# Altium project LimeSDR-X3_1v2.PrjPcb (part 9 of 20)

## Sheet 18_FPGA_B16_B33_B34_B35.SchDoc: FPGA Banks 16, 33, 34, 35
size A3; Organization: Lime Microsystems; Address1: Surrey Tech Centre; Address2: Guildford GU2 7YG; Address3: Surrey; Address4: United Kingdom; Revision: 1.2; SheetNumber: 18; SheetTotal: 31
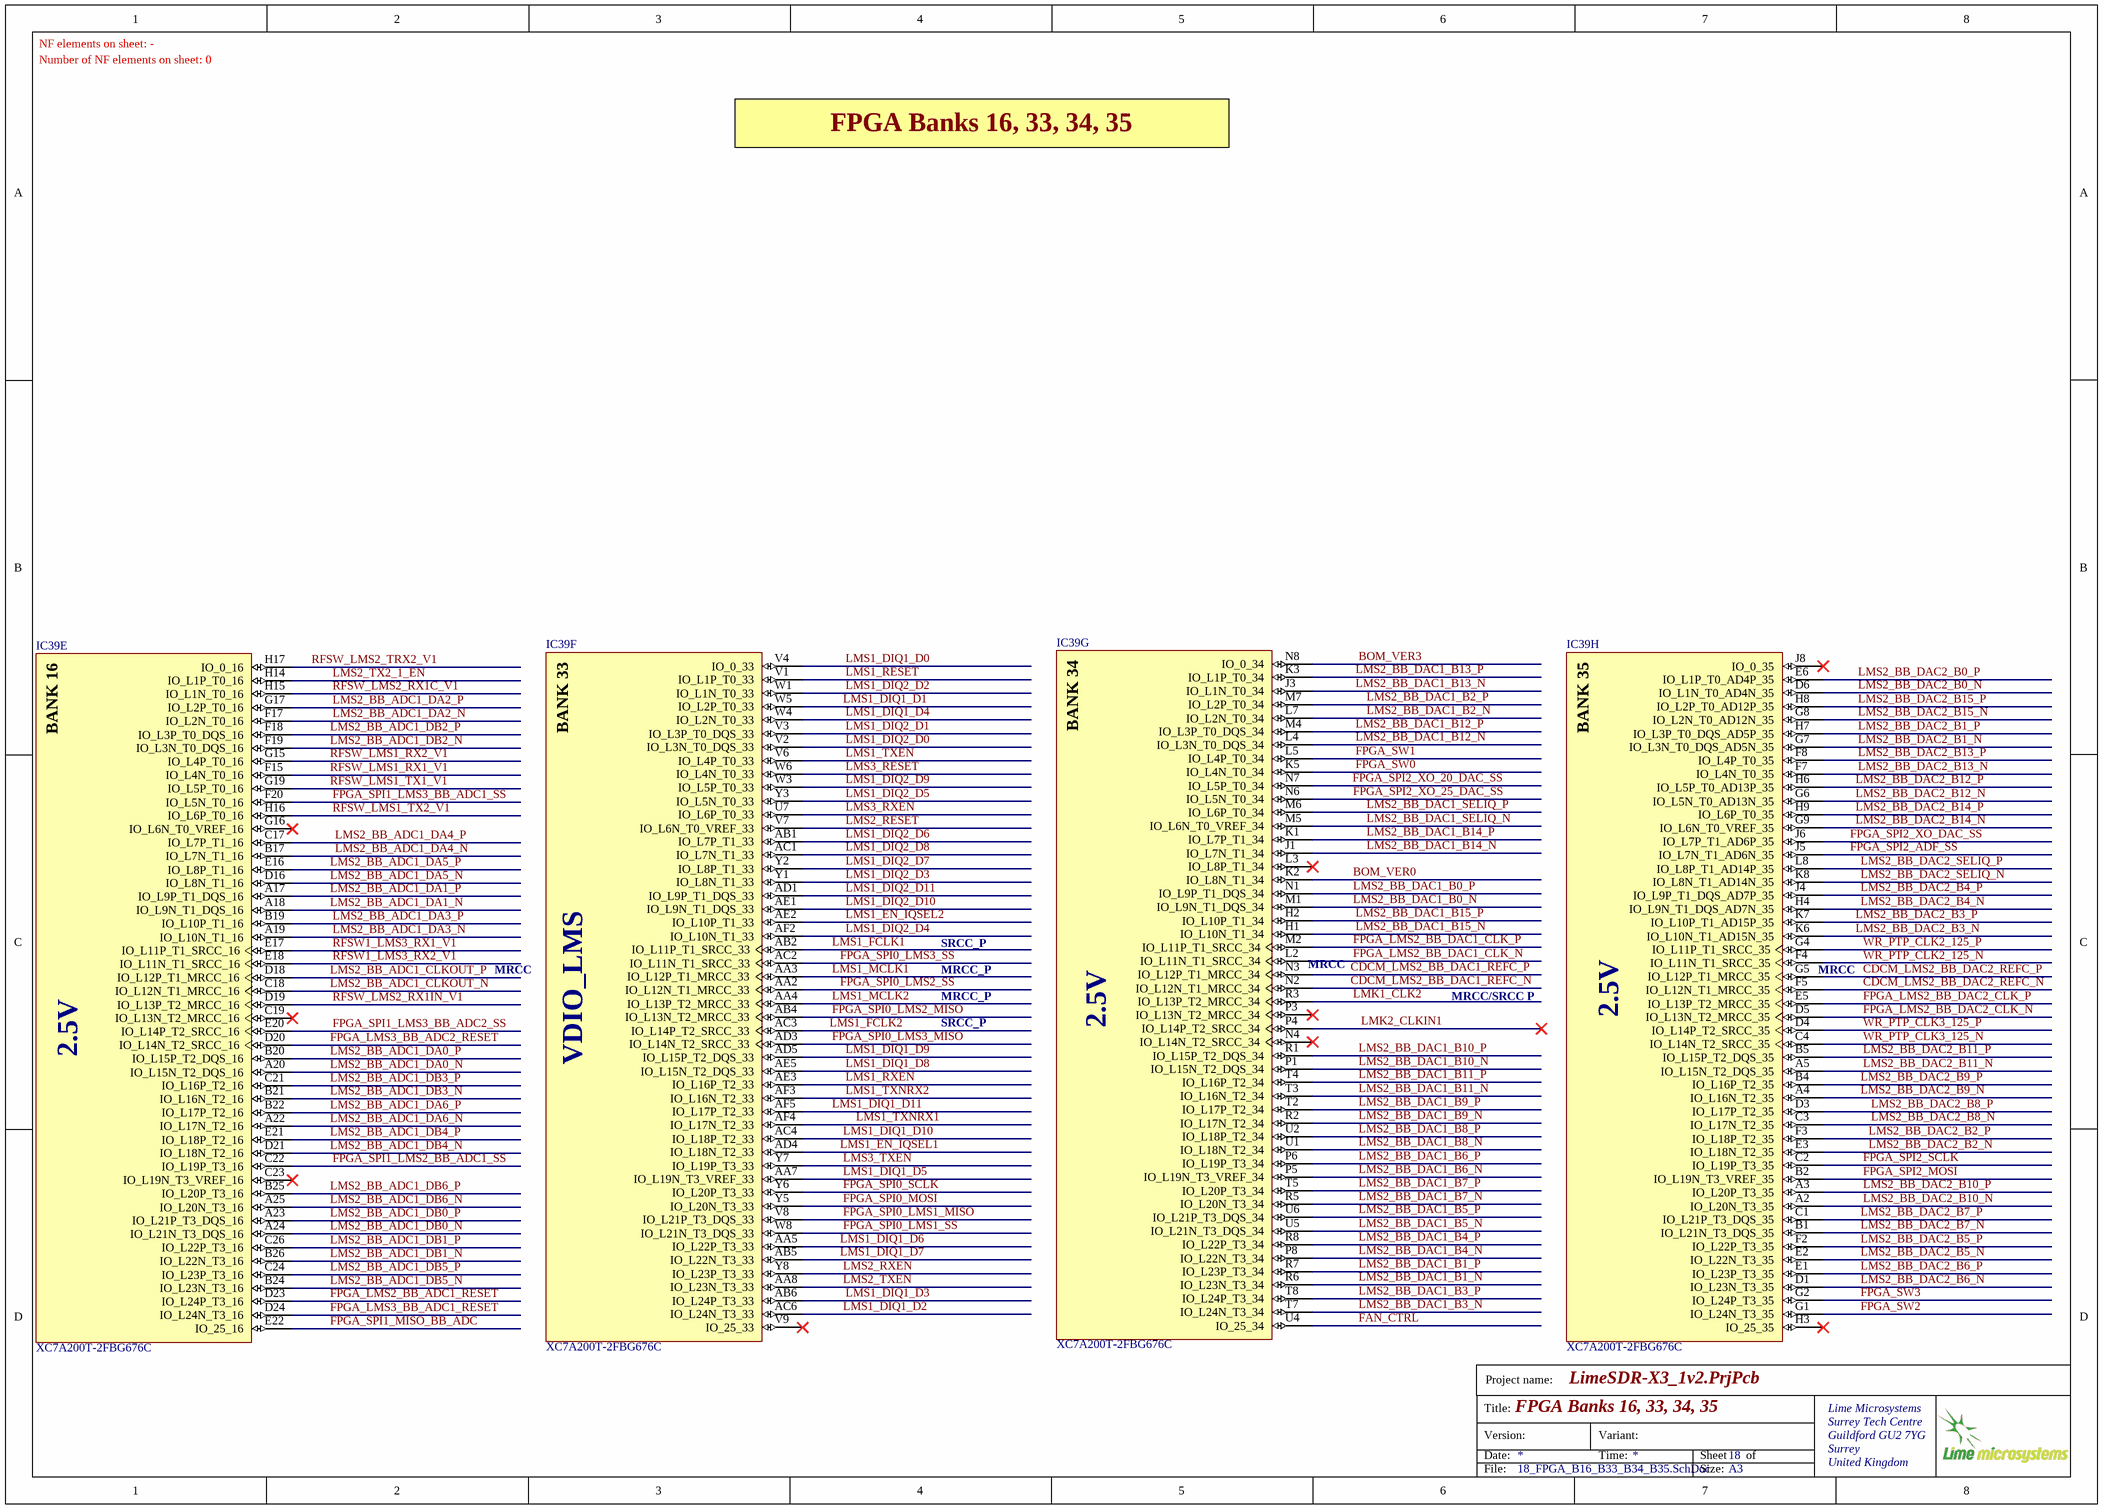
[diagram p17: 18_FPGA_B16_B33_B34_B35.SchDoc]

### Parts
IC39  XC7A200T-2FBG676C  [XC7A200T-2FBG676C_FBG676]  (parts E,F,G,H of 14)

### Nets
BOM_VER0: IC39.K2(IO_L8N_T1_34)
BOM_VER3: IC39.N8(IO_0_34)
CDCM_LMS2_BB_DAC1_REFC_N: IC39.N2(IO_L12N_T1_MRCC_34)
CDCM_LMS2_BB_DAC1_REFC_P: IC39.N3(IO_L12P_T1_MRCC_34)
CDCM_LMS2_BB_DAC2_REFC_N: IC39.F5(IO_L12N_T1_MRCC_35)
CDCM_LMS2_BB_DAC2_REFC_P: IC39.G5(IO_L12P_T1_MRCC_35)
FAN_CTRL: IC39.U4(IO_25_34)
FPGA_LMS2_BB_ADC1_RESET: IC39.D23(IO_L24P_T3_16)
FPGA_LMS2_BB_DAC1_CLK_N: IC39.L2(IO_L11N_T1_SRCC_34)
FPGA_LMS2_BB_DAC1_CLK_P: IC39.M2(IO_L11P_T1_SRCC_34)
FPGA_LMS2_BB_DAC2_CLK_N: IC39.D5(IO_L13N_T2_MRCC_35)
FPGA_LMS2_BB_DAC2_CLK_P: IC39.E5(IO_L13P_T2_MRCC_35)
FPGA_LMS3_BB_ADC1_RESET: IC39.D24(IO_L24N_T3_16)
FPGA_LMS3_BB_ADC2_RESET: IC39.D20(IO_L14N_T2_SRCC_16)
FPGA_SPI0_LMS1_MISO: IC39.V8(IO_L21P_T3_DQS_33)
FPGA_SPI0_LMS1_SS: IC39.W8(IO_L21N_T3_DQS_33)
FPGA_SPI0_LMS2_MISO: IC39.AB4(IO_L13N_T2_MRCC_33)
FPGA_SPI0_LMS2_SS: IC39.AA2(IO_L12N_T1_MRCC_33)
FPGA_SPI0_LMS3_MISO: IC39.AD3(IO_L14N_T2_SRCC_33)
FPGA_SPI0_LMS3_SS: IC39.AC2(IO_L11N_T1_SRCC_33)
FPGA_SPI0_MOSI: IC39.Y5(IO_L20N_T3_33)
FPGA_SPI0_SCLK: IC39.Y6(IO_L20P_T3_33)
FPGA_SPI1_LMS2_BB_ADC1_SS: IC39.C22(IO_L19P_T3_16)
FPGA_SPI1_LMS3_BB_ADC1_SS: IC39.F20(IO_L5N_T0_16)
FPGA_SPI1_LMS3_BB_ADC2_SS: IC39.E20(IO_L14P_T2_SRCC_16)
FPGA_SPI1_MISO_BB_ADC: IC39.E22(IO_25_16)
FPGA_SPI2_ADF_SS: IC39.J5(IO_L7N_T1_AD6N_35)
FPGA_SPI2_MOSI: IC39.B2(IO_L19N_T3_VREF_35)
FPGA_SPI2_SCLK: IC39.C2(IO_L19P_T3_35)
FPGA_SPI2_XO_20_DAC_SS: IC39.N7(IO_L5P_T0_34)
FPGA_SPI2_XO_25_DAC_SS: IC39.N6(IO_L5N_T0_34)
FPGA_SPI2_XO_DAC_SS: IC39.J6(IO_L7P_T1_AD6P_35)
FPGA_SW0: IC39.K5(IO_L4N_T0_34)
FPGA_SW1: IC39.L5(IO_L4P_T0_34)
FPGA_SW2: IC39.G1(IO_L24N_T3_35)
FPGA_SW3: IC39.G2(IO_L24P_T3_35)
LMK1_CLK2: IC39.R3(IO_L13P_T2_MRCC_34)
LMK2_CLKIN1: IC39.P4(IO_L14P_T2_SRCC_34)
LMS1_DIQ1_D0: IC39.V4(IO_0_33)
LMS1_DIQ1_D1: IC39.W5(IO_L2P_T0_33)
LMS1_DIQ1_D2: IC39.AC6(IO_L24N_T3_33)
LMS1_DIQ1_D3: IC39.AB6(IO_L24P_T3_33)
LMS1_DIQ1_D4: IC39.W4(IO_L2N_T0_33)
LMS1_DIQ1_D5: IC39.AA7(IO_L19N_T3_VREF_33)
LMS1_DIQ1_D6: IC39.AA5(IO_L22P_T3_33)
LMS1_DIQ1_D7: IC39.AB5(IO_L22N_T3_33)
LMS1_DIQ1_D8: IC39.AE5(IO_L15N_T2_DQS_33)
LMS1_DIQ1_D9: IC39.AD5(IO_L15P_T2_DQS_33)
LMS1_DIQ1_D10: IC39.AC4(IO_L18P_T2_33)
LMS1_DIQ1_D11: IC39.AF5(IO_L17P_T2_33)
LMS1_DIQ2_D0: IC39.V2(IO_L3N_T0_DQS_33)
LMS1_DIQ2_D1: IC39.V3(IO_L3P_T0_DQS_33)
LMS1_DIQ2_D2: IC39.W1(IO_L1N_T0_33)
LMS1_DIQ2_D3: IC39.Y1(IO_L8N_T1_33)
LMS1_DIQ2_D4: IC39.AF2(IO_L10N_T1_33)
LMS1_DIQ2_D5: IC39.Y3(IO_L5N_T0_33)
LMS1_DIQ2_D6: IC39.AB1(IO_L7P_T1_33)
LMS1_DIQ2_D7: IC39.Y2(IO_L8P_T1_33)
LMS1_DIQ2_D8: IC39.AC1(IO_L7N_T1_33)
LMS1_DIQ2_D9: IC39.W3(IO_L5P_T0_33)
LMS1_DIQ2_D10: IC39.AE1(IO_L9N_T1_DQS_33)
LMS1_DIQ2_D11: IC39.AD1(IO_L9P_T1_DQS_33)
LMS1_EN_IQSEL1: IC39.AD4(IO_L18N_T2_33)
LMS1_EN_IQSEL2: IC39.AE2(IO_L10P_T1_33)
LMS1_FCLK1: IC39.AB2(IO_L11P_T1_SRCC_33)
LMS1_FCLK2: IC39.AC3(IO_L14P_T2_SRCC_33)
LMS1_MCLK1: IC39.AA3(IO_L12P_T1_MRCC_33)
LMS1_MCLK2: IC39.AA4(IO_L13P_T2_MRCC_33)
LMS1_RESET: IC39.V1(IO_L1P_T0_33)
LMS1_RXEN: IC39.AE3(IO_L16P_T2_33)
LMS1_TXEN: IC39.V6(IO_L4P_T0_33)
LMS1_TXNRX1: IC39.AF4(IO_L17N_T2_33)
LMS1_TXNRX2: IC39.AF3(IO_L16N_T2_33)
LMS2_BB_ADC1_CLKOUT_N: IC39.C18(IO_L12N_T1_MRCC_16)
LMS2_BB_ADC1_CLKOUT_P: IC39.D18(IO_L12P_T1_MRCC_16)
LMS2_BB_ADC1_DA0_N: IC39.A20(IO_L15N_T2_DQS_16)
LMS2_BB_ADC1_DA0_P: IC39.B20(IO_L15P_T2_DQS_16)
LMS2_BB_ADC1_DA1_N: IC39.A18(IO_L9N_T1_DQS_16)
LMS2_BB_ADC1_DA1_P: IC39.A17(IO_L9P_T1_DQS_16)
LMS2_BB_ADC1_DA2_N: IC39.F17(IO_L2N_T0_16)
LMS2_BB_ADC1_DA2_P: IC39.G17(IO_L2P_T0_16)
LMS2_BB_ADC1_DA3_N: IC39.A19(IO_L10N_T1_16)
LMS2_BB_ADC1_DA3_P: IC39.B19(IO_L10P_T1_16)
LMS2_BB_ADC1_DA4_N: IC39.B17(IO_L7N_T1_16)
LMS2_BB_ADC1_DA4_P: IC39.C17(IO_L7P_T1_16)
LMS2_BB_ADC1_DA5_N: IC39.D16(IO_L8N_T1_16)
LMS2_BB_ADC1_DA5_P: IC39.E16(IO_L8P_T1_16)
LMS2_BB_ADC1_DA6_N: IC39.A22(IO_L17N_T2_16)
LMS2_BB_ADC1_DA6_P: IC39.B22(IO_L17P_T2_16)
LMS2_BB_ADC1_DB0_N: IC39.A24(IO_L21N_T3_DQS_16)
LMS2_BB_ADC1_DB0_P: IC39.A23(IO_L21P_T3_DQS_16)
LMS2_BB_ADC1_DB1_N: IC39.B26(IO_L22N_T3_16)
LMS2_BB_ADC1_DB1_P: IC39.C26(IO_L22P_T3_16)
LMS2_BB_ADC1_DB2_N: IC39.F19(IO_L3N_T0_DQS_16)
LMS2_BB_ADC1_DB2_P: IC39.F18(IO_L3P_T0_DQS_16)
LMS2_BB_ADC1_DB3_N: IC39.B21(IO_L16N_T2_16)
LMS2_BB_ADC1_DB3_P: IC39.C21(IO_L16P_T2_16)
LMS2_BB_ADC1_DB4_N: IC39.D21(IO_L18N_T2_16)
LMS2_BB_ADC1_DB4_P: IC39.E21(IO_L18P_T2_16)
LMS2_BB_ADC1_DB5_N: IC39.B24(IO_L23N_T3_16)
LMS2_BB_ADC1_DB5_P: IC39.C24(IO_L23P_T3_16)
LMS2_BB_ADC1_DB6_N: IC39.A25(IO_L20N_T3_16)
LMS2_BB_ADC1_DB6_P: IC39.B25(IO_L20P_T3_16)
LMS2_BB_DAC1_B0_N: IC39.M1(IO_L9N_T1_DQS_34)
LMS2_BB_DAC1_B0_P: IC39.N1(IO_L9P_T1_DQS_34)
LMS2_BB_DAC1_B1_N: IC39.R6(IO_L23N_T3_34)
LMS2_BB_DAC1_B1_P: IC39.R7(IO_L23P_T3_34)
LMS2_BB_DAC1_B2_N: IC39.L7(IO_L2N_T0_34)
LMS2_BB_DAC1_B2_P: IC39.M7(IO_L2P_T0_34)
LMS2_BB_DAC1_B3_N: IC39.T7(IO_L24N_T3_34)
LMS2_BB_DAC1_B3_P: IC39.T8(IO_L24P_T3_34)
LMS2_BB_DAC1_B4_N: IC39.P8(IO_L22N_T3_34)
LMS2_BB_DAC1_B4_P: IC39.R8(IO_L22P_T3_34)
LMS2_BB_DAC1_B5_N: IC39.U5(IO_L21N_T3_DQS_34)
LMS2_BB_DAC1_B5_P: IC39.U6(IO_L21P_T3_DQS_34)
LMS2_BB_DAC1_B6_N: IC39.P5(IO_L19N_T3_VREF_34)
LMS2_BB_DAC1_B6_P: IC39.P6(IO_L19P_T3_34)
LMS2_BB_DAC1_B7_N: IC39.R5(IO_L20N_T3_34)
LMS2_BB_DAC1_B7_P: IC39.T5(IO_L20P_T3_34)
LMS2_BB_DAC1_B8_N: IC39.U1(IO_L18N_T2_34)
LMS2_BB_DAC1_B8_P: IC39.U2(IO_L18P_T2_34)
LMS2_BB_DAC1_B9_N: IC39.R2(IO_L17N_T2_34)
LMS2_BB_DAC1_B9_P: IC39.T2(IO_L17P_T2_34)
LMS2_BB_DAC1_B10_N: IC39.P1(IO_L15N_T2_DQS_34)
LMS2_BB_DAC1_B10_P: IC39.R1(IO_L15P_T2_DQS_34)
LMS2_BB_DAC1_B11_N: IC39.T3(IO_L16N_T2_34)
LMS2_BB_DAC1_B11_P: IC39.T4(IO_L16P_T2_34)
LMS2_BB_DAC1_B12_N: IC39.L4(IO_L3N_T0_DQS_34)
LMS2_BB_DAC1_B12_P: IC39.M4(IO_L3P_T0_DQS_34)
LMS2_BB_DAC1_B13_N: IC39.J3(IO_L1N_T0_34)
LMS2_BB_DAC1_B13_P: IC39.K3(IO_L1P_T0_34)
LMS2_BB_DAC1_B14_N: IC39.J1(IO_L7N_T1_34)
LMS2_BB_DAC1_B14_P: IC39.K1(IO_L7P_T1_34)
LMS2_BB_DAC1_B15_N: IC39.H1(IO_L10N_T1_34)
LMS2_BB_DAC1_B15_P: IC39.H2(IO_L10P_T1_34)
LMS2_BB_DAC1_SELIQ_N: IC39.M5(IO_L6N_T0_VREF_34)
LMS2_BB_DAC1_SELIQ_P: IC39.M6(IO_L6P_T0_34)
LMS2_BB_DAC2_B0_N: IC39.D6(IO_L1N_T0_AD4N_35)
LMS2_BB_DAC2_B0_P: IC39.E6(IO_L1P_T0_AD4P_35)
LMS2_BB_DAC2_B1_N: IC39.G7(IO_L3N_T0_DQS_AD5N_35)
LMS2_BB_DAC2_B1_P: IC39.H7(IO_L3P_T0_DQS_AD5P_35)
LMS2_BB_DAC2_B2_N: IC39.E3(IO_L18N_T2_35)
LMS2_BB_DAC2_B2_P: IC39.F3(IO_L18P_T2_35)
LMS2_BB_DAC2_B3_N: IC39.K6(IO_L10N_T1_AD15N_35)
LMS2_BB_DAC2_B3_P: IC39.K7(IO_L10P_T1_AD15P_35)
LMS2_BB_DAC2_B4_N: IC39.H4(IO_L9N_T1_DQS_AD7N_35)
LMS2_BB_DAC2_B4_P: IC39.J4(IO_L9P_T1_DQS_AD7P_35)
LMS2_BB_DAC2_B5_N: IC39.E2(IO_L22N_T3_35)
LMS2_BB_DAC2_B5_P: IC39.F2(IO_L22P_T3_35)
LMS2_BB_DAC2_B6_N: IC39.D1(IO_L23N_T3_35)
LMS2_BB_DAC2_B6_P: IC39.E1(IO_L23P_T3_35)
LMS2_BB_DAC2_B7_N: IC39.B1(IO_L21N_T3_DQS_35)
LMS2_BB_DAC2_B7_P: IC39.C1(IO_L21P_T3_DQS_35)
LMS2_BB_DAC2_B8_N: IC39.C3(IO_L17N_T2_35)
LMS2_BB_DAC2_B8_P: IC39.D3(IO_L17P_T2_35)
LMS2_BB_DAC2_B9_N: IC39.A4(IO_L16N_T2_35)
LMS2_BB_DAC2_B9_P: IC39.B4(IO_L16P_T2_35)
LMS2_BB_DAC2_B10_N: IC39.A2(IO_L20N_T3_35)
LMS2_BB_DAC2_B10_P: IC39.A3(IO_L20P_T3_35)
LMS2_BB_DAC2_B11_N: IC39.A5(IO_L15N_T2_DQS_35)
LMS2_BB_DAC2_B11_P: IC39.B5(IO_L15P_T2_DQS_35)
LMS2_BB_DAC2_B12_N: IC39.G6(IO_L5N_T0_AD13N_35)
LMS2_BB_DAC2_B12_P: IC39.H6(IO_L5P_T0_AD13P_35)
LMS2_BB_DAC2_B13_N: IC39.F7(IO_L4N_T0_35)
LMS2_BB_DAC2_B13_P: IC39.F8(IO_L4P_T0_35)
LMS2_BB_DAC2_B14_N: IC39.G9(IO_L6N_T0_VREF_35)
LMS2_BB_DAC2_B14_P: IC39.H9(IO_L6P_T0_35)
LMS2_BB_DAC2_B15_N: IC39.G8(IO_L2N_T0_AD12N_35)
LMS2_BB_DAC2_B15_P: IC39.H8(IO_L2P_T0_AD12P_35)
LMS2_BB_DAC2_SELIQ_N: IC39.K8(IO_L8N_T1_AD14N_35)
LMS2_BB_DAC2_SELIQ_P: IC39.L8(IO_L8P_T1_AD14P_35)
LMS2_RESET: IC39.V7(IO_L6N_T0_VREF_33)
LMS2_RXEN: IC39.Y8(IO_L23P_T3_33)
LMS2_TX2_1_EN: IC39.H14(IO_L1P_T0_16)
LMS2_TXEN: IC39.AA8(IO_L23N_T3_33)
LMS3_RESET: IC39.W6(IO_L4N_T0_33)
LMS3_RXEN: IC39.U7(IO_L6P_T0_33)
LMS3_TXEN: IC39.Y7(IO_L19P_T3_33)
RFSW1_LMS3_RX1_V1: IC39.E17(IO_L11P_T1_SRCC_16)
RFSW1_LMS3_RX2_V1: IC39.E18(IO_L11N_T1_SRCC_16)
RFSW_LMS1_RX1_V1: IC39.F15(IO_L4N_T0_16)
RFSW_LMS1_RX2_V1: IC39.G15(IO_L4P_T0_16)
RFSW_LMS1_TX1_V1: IC39.G19(IO_L5P_T0_16)
RFSW_LMS1_TX2_V1: IC39.H16(IO_L6P_T0_16)
RFSW_LMS2_RX1C_V1: IC39.H15(IO_L1N_T0_16)
RFSW_LMS2_RX1IN_V1: IC39.D19(IO_L13P_T2_MRCC_16)
RFSW_LMS2_TRX2_V1: IC39.H17(IO_0_16)
WR_PTP_CLK2_125_N: IC39.F4(IO_L11N_T1_SRCC_35)
WR_PTP_CLK2_125_P: IC39.G4(IO_L11P_T1_SRCC_35)
WR_PTP_CLK3_125_N: IC39.C4(IO_L14N_T2_SRCC_35)
WR_PTP_CLK3_125_P: IC39.D4(IO_L14P_T2_SRCC_35)

Not connected (* = marked no-connect by the designer): IC39 C19(IO_L13N_T2_MRCC_16)* C23(IO_L19N_T3_VREF_16)* G16(IO_L6N_T0_VREF_16)* H3(IO_25_35)* J8(IO_0_35)* L3(IO_L8P_T1_34)* N4(IO_L14N_T2_SRCC_34)* P3(IO_L13N_T2_MRCC_34)* V9(IO_25_33)*

### Notes on the sheet
- NF elements on sheet: -
- Number of NF elements on sheet: 0
- FPGA Banks 16, 33, 34, 35
- MRCC
- MRCC_P
- SRCC_P
- (near IC39) MRCC
- 2.5V
- MRCC/SRCC P
- VDIO_LMS
- Project name:
- Title:
- Version:
- Date:
- Variant:
- Time:
- Sheet
- of
- File:
- Size:
- A3
- (in symbol XC7A200T-2FBG676C, part E) BANK 16
- (in symbol XC7A200T-2FBG676C, part F) BANK 33
- (in symbol XC7A200T-2FBG676C, part G) BANK 34
- (in symbol XC7A200T-2FBG676C, part H) BANK 35

### Library data of the parts
IC39 = XC7A200T-2FBG676C: as IC39 on sheet 17_FPGA_B12_B13_B14_B15; ComponentLink1Description: Manufacturer URL; ComponentLink1URL: http://www.xilinx.com/; ComponentLink2Description: Datasheet; ComponentLink2URL: http://www.xilinx.com/support/documentation/data_sheets/ds180_7Series_Overview.pdf; ComponentLink3Description: Package Specification; ComponentLink3URL: http://www.xilinx.com/support/documentation/user_guides/ug475_7Series_Pkg_Pinout.pdf; ComponentLink4Description: DC and Switching Characteristics; ComponentLink4URL: http://www.xilinx.com/support/documentation/data_sheets/ds181_Artix_7_Data_Sheet.pdf; ComponentLink5Description: Package File; ComponentLink5URL: http://www.xilinx.com/support/packagefiles/a7packages/xc7a200tfbg676pkg.txt; ComponentLink6Description: Packaging and Pinout; ComponentLink6URL: http://www.xilinx.com/support/documentation/user_guides/ug475_7Series_Pkg_Pinout.pdf; Supplier 1: Digi-Key; Supplier Part Number 1: 122-1865-ND; Manufacturer Part Number 1: XC7A200T-2FBG676C; Stock 1: 124; Pricing 1: 1=261,30000 (USD); RoHS: Yes; Case/Package: FCBGA; Number of Pins: 676; Contact Plating: Copper,Tin,Silver; Min Operating Temperature: 0°C; Max Operating Temperature: 85°C; ComponentLink7URL: https://datasheet.ciiva.com/15066/ds181-artix-7-data-sheet-15066344.pdf?src-supplier=Digi-Key; ComponentLink7Description: https://datasheet.ciiva.com/15066/ds181-artix-7-data-sheet-15066344.pdf?src-supplier=Digi-Key; ComponentLink8URL: https://datasheet.ciiva.com/48475/ds180-7series-overview-48475947.pdf?src-supplier=Avnet; ComponentLink8Description: https://datasheet.ciiva.com/48475/ds180-7series-overview-48475947.pdf?src-supplier=Avnet